# EAGLE design LaserModule (EAGLE 7.5.0)
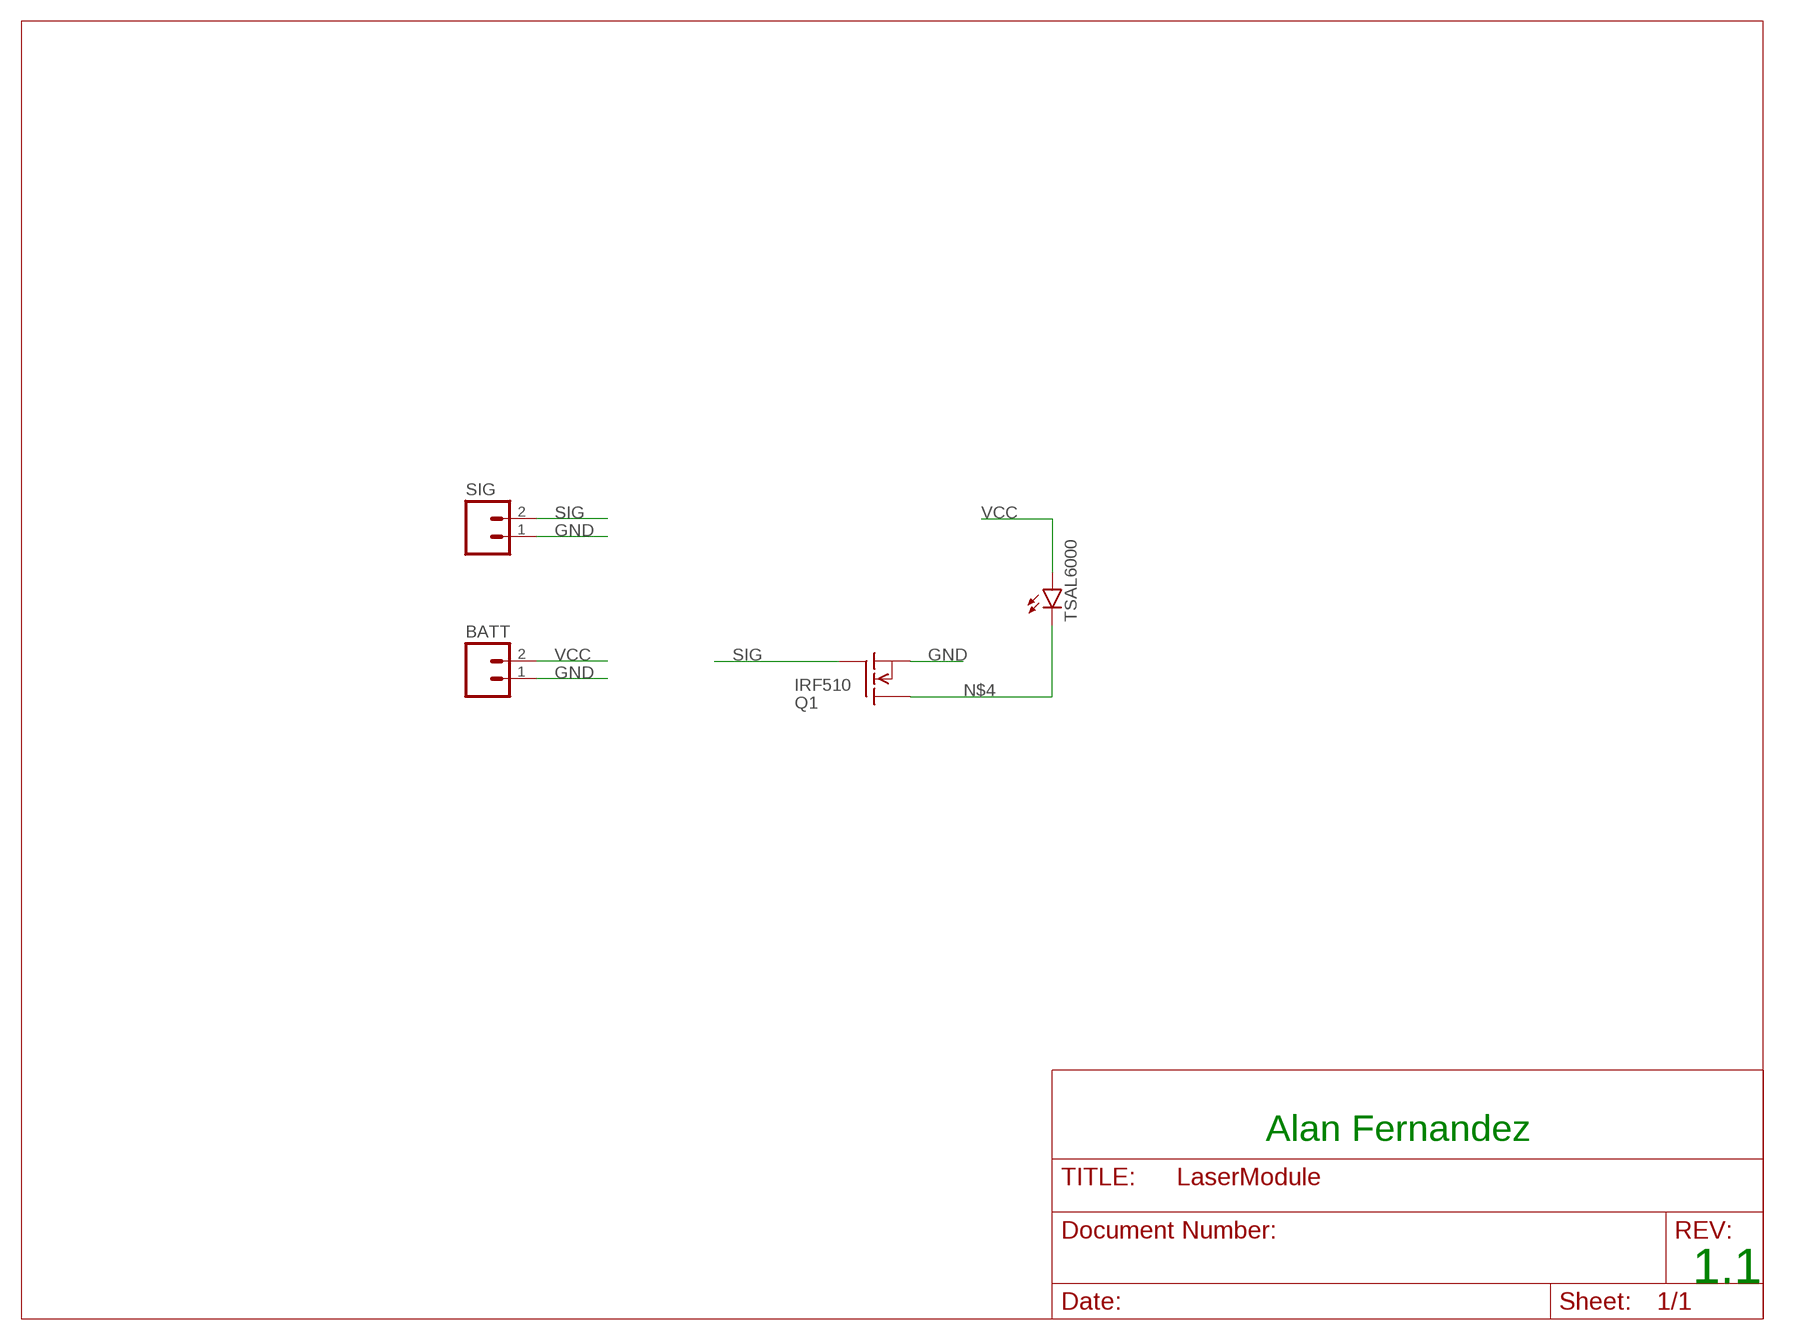
[diagram p0: schematic, sheet 1]

## Parts
BATT  M02PTH  [1X02]
Q1  IRF510  [TO220]
SIG  M02PTH  [1X02]
TSAL6000  LED5MM  [LED5MM]

## Nets
GND: BATT.1 Q1.3(S) SIG.1
N$4: Q1.2(D) TSAL6000.K(C)
SIG: Q1.1(G) SIG.2
VCC: BATT.2 TSAL6000.A

## Notes on the sheet
- Alan Fernandez
- 1.1

## Library data of the parts
BATT SIG = SparkFun-Connectors:M02: Standard 2-pin 0.1" header. Use with - straight break away headers ( PRT-00116) - right angle break away headers (PRT-00553) - swiss pins (PRT-00743) - machine pins (PRT-00117) - female headers (PRT-00115) Molex polarized connector foot print use with: PRT-08233 with associated crimp pins and housings. 2.54_SCREWTERM for use with PRT-10571. 3.5mm Screw Terminal footprints for PRT-08084 5mm Screw Terminal footprints for use with PRT-08432
Q1 = transistor-fet:IRF510: N-Channel Enhancement MOSFET (HEXFET); 100V; 5,6A; 0,54Ohm
TSAL6000 = SparkFun-LED:LED: LEDs Standard schematic elements and footprints for 5mm, 3mm, 1206, and 0603 sized LEDs. 5mm - Spark Fun Electronics SKU : COM-00529 (and others)

## Board
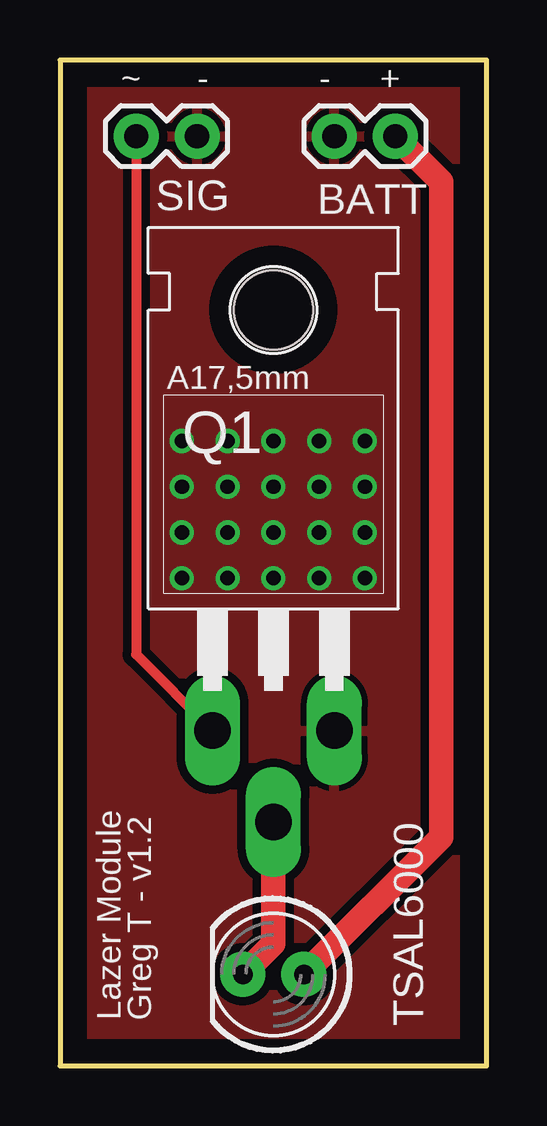
[diagram p1: board, top side]
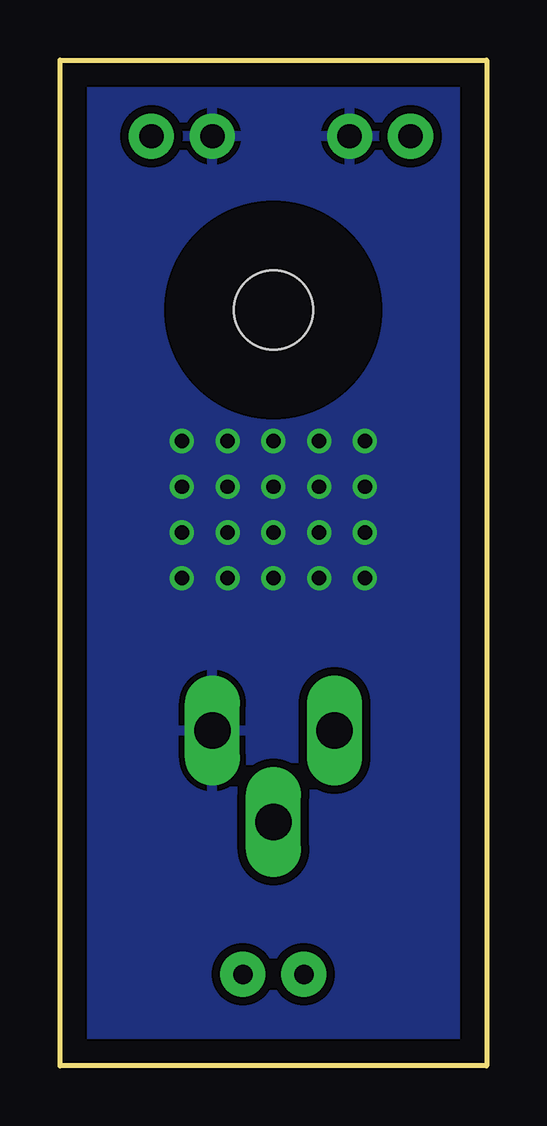
[diagram p2: board, bottom side, seen from below]

Size 17.78 x 41.91 mm. Coordinates in mm from the lower left corner, seen from the top.
Outline: 0,41.91 0,0 17.78,0 17.78,41.91 0,41.91
Copper layers (1*16): Top 0.035mm / dielectric 1.5mm / Bottom 0.035mm
Design rules "default": minimum track width 10mil, minimum drill 24mil, track to track 8mil, track to pad 8mil, pad to pad 8mil, via to via 8mil, smd to smd 8mil, copper to edge 40mil, drill to drill 8mil, minimum pad ring 10mil, minimum via ring 8mil, stop-mask expansion 4mil, vias tented up to drill 0mil, thermal gap 10mil

### Footprints (pad centres in the part's own frame; a part is rotated, then mirrored left to right if it is on the bottom)
1X02 = drill 1.016 pad 1.88: 1 0,0; 2 2.54,0
TO220 = drill 1.524 long: 1 -2.54,-6.35; 2 0,-10.16; 3 2.54,-6.35 | hole 3.302: 0,11.176
LED5MM = drill 0.813 pad 1.88: A -1.27,0; K 1.27,0

### Placement (x,y rotation side)
BATT  11.43,38.73 0 top
Q1  8.89,20.32 0 top
SIG  5.72,38.73 180 top
TSAL6000  8.89,3.81 180 top

### Tracks (layer width: path | path; a pad name or v marks a point on that pad's centre or on a via)
GND  (via drill 0.6)
  other vias: 5.08,26.03 6.98,26.03 8.89,26.03 10.8,26.03 12.7,26.03 5.08,24.13 6.98,24.13 8.89,24.13 10.8,24.13 12.7,24.13 5.08,22.23 6.98,22.23 8.89,22.23 10.8,22.23 12.7,22.23 5.08,20.32 6.98,20.32 8.89,20.32 10.8,20.32 12.7,20.32
  pour Bottom (isolate 0.356): 0,41.91 0,0 17.78,0 17.78,41.91
  pour Top (isolate 0.356): 0,41.91 17.78,41.91 17.78,0 0,0
N$4
  Top 1.016: Q1.2 8.89,5.08 TSAL6000.K
SIG
  Top 0.406: SIG.2 3.18,17.14 Q1.1
VCC
  Top 1.016: BATT.2 15.88,36.83 15.88,9.52 TSAL6000.A

### Text on the board
tPlace: Lazer Module
tNames: ~ | - | - | + | Greg T - v1.2